# EAGLE schematic teensyv (EAGLE 6.6.0)
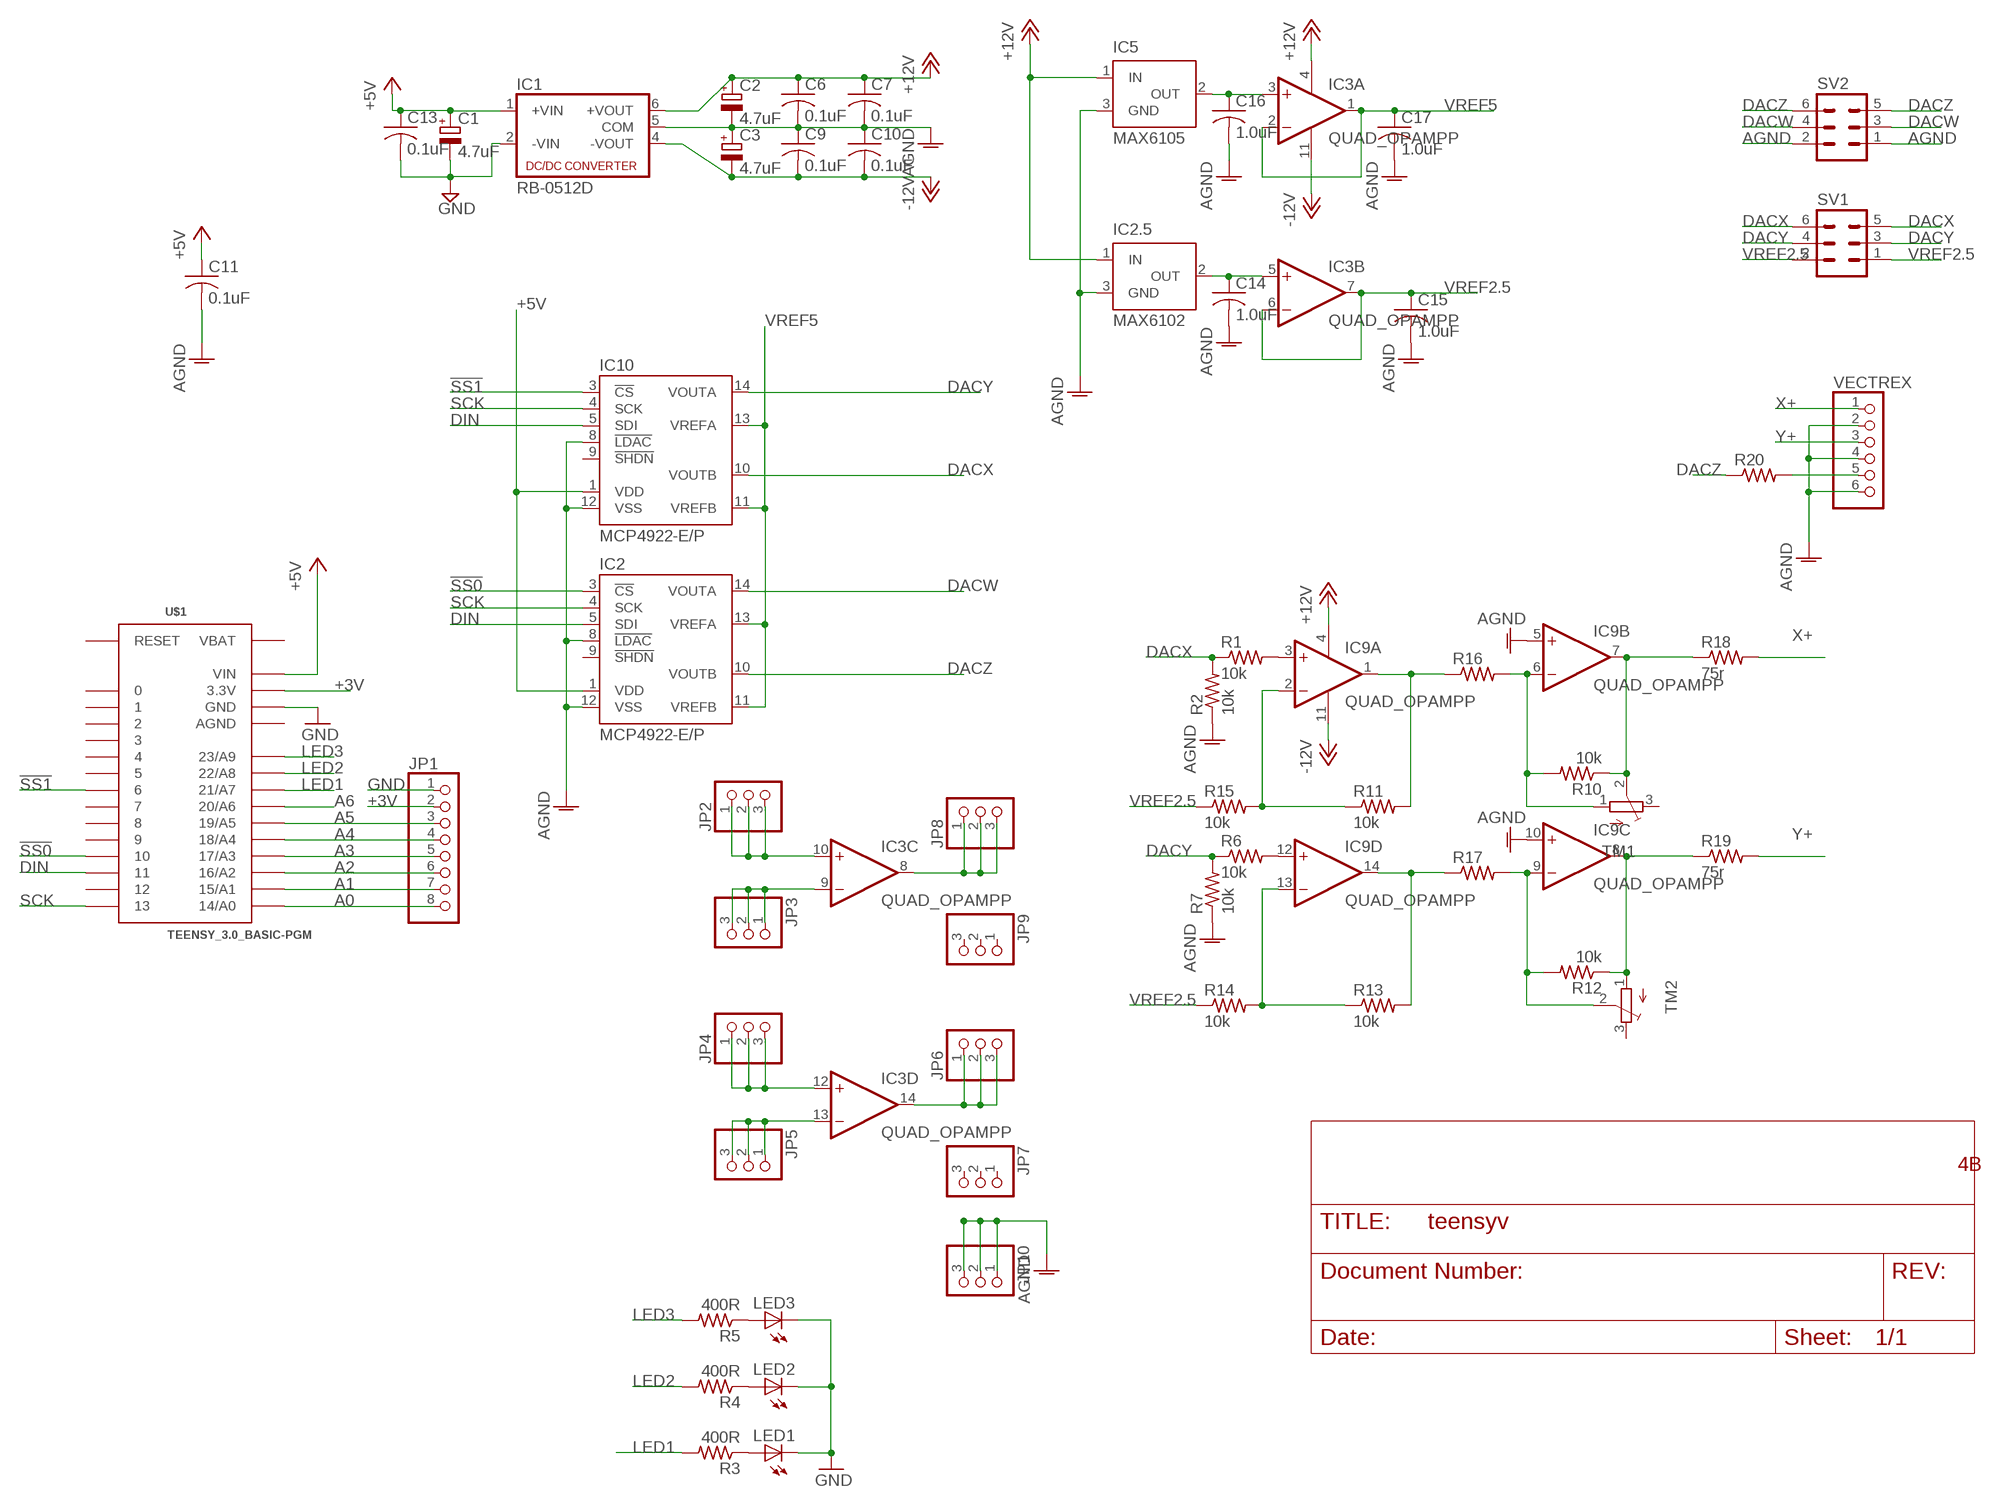
[diagram p0: schematic, sheet 1]

## Parts
C1  4.7uF  CPOL-EUE1.8-4  [E1,8-4]
C2  4.7uF  CPOL-EUE1.8-4  [E1,8-4]
C3  4.7uF  CPOL-EUE1.8-4  [E1,8-4]
C6  0.1uF  C-US025-024X044  [C025-024X044]
C7  0.1uF  C-US025-024X044  [C025-024X044]
C9  0.1uF  C-US025-024X044  [C025-024X044]
C10  0.1uF  C-US025-024X044  [C025-024X044]
C11  0.1uF  C-US025-024X044  [C025-024X044]
C13  0.1uF  C-US025-024X044  [C025-024X044]
C14  1.0uF  C-US025-024X044  [C025-024X044]
C15  1.0uF  C-US025-024X044  [C025-024X044]
C16  1.0uF  C-US025-024X044  [C025-024X044]
C17  1.0uF  C-US025-024X044  [C025-024X044]
IC1  RB-0512D  NMA  [NMA]
IC2  MCP4922-E/P  [DIL14]
IC2.5  MAX6102  MAX6520  [SOT23]
IC3  QUAD_OPAMPP  [DIL14]
IC5  MAX6105  MAX6520  [SOT23]
IC9  QUAD_OPAMPP  [DIL14]
IC10  MCP4922-E/P  [DIL14]
JP1  PINHD-1X8CLEANBIG  [1X08-CLEANBIG]
JP2  PINHD-1X3  [1X03]
JP3  PINHD-1X3  [1X03]
JP4  PINHD-1X3  [1X03]
JP5  PINHD-1X3  [1X03]
JP6  PINHD-1X3  [1X03]
JP7  PINHD-1X3  [1X03]
JP8  PINHD-1X3  [1X03]
JP9  PINHD-1X3  [1X03]
JP10  PINHD-1X3  [1X03]
LED1  LED5MM  [LED5MM]
LED2  LED5MM  [LED5MM]
LED3  LED5MM  [LED5MM]
R1  10k  R-US_0204/2V  [0204V]
R2  10k  R-US_0204/2V  [0204V]
R3  400R  R-US_0204/2V  [0204V]
R4  400R  R-US_0204/2V  [0204V]
R5  400R  R-US_0204/2V  [0204V]
R6  10k  R-US_0204/2V  [0204V]
R7  10k  R-US_0204/2V  [0204V]
R10  10k  R-US_0204/2V  [0204V]
R11  10k  R-US_0204/2V  [0204V]
R12  10k  R-US_0204/2V  [0204V]
R13  10k  R-US_0204/2V  [0204V]
R14  10k  R-US_0204/2V  [0204V]
R15  10k  R-US_0204/2V  [0204V]
R16  R-US_0204/7  [0204/7]
R17  R-US_0204/7  [0204/7]
R18  75r  R-US_0204/2V  [0204V]
R19  75r  R-US_0204/2V  [0204V]
R20  R-US_0204/7  [0204/7]
SV1  MA03-2  [MA03-2]
SV2  MA03-2  [MA03-2]
TM1  TRIMPOTTC33X  [TC33X]
TM2  TRIMPOTTC33X  [TC33X]
U$1  TEENSY_3.0_BASIC-PGM  [TEENSY_3.0_BASIC-PGM]
VECTREX  PINHD-1X6  [1X06]

## Nets
!SS0: IC2.3(!CS) U$1.10
!SS1: IC10.3(!CS) U$1.6
+3V: JP1.2 U$1.3.3V U$1.3.3V1(3.3V)
+5V: C1.+ C11.1 C13.1 IC1.1(+VIN) IC2.1(VDD) IC10.1(VDD) U$1.VIN
+12V: C2.+ C6.1 C7.1 IC1.6(+VOUT) IC2.5.1(IN) IC3.4(P:V+) IC5.1(IN) IC9.4(P:V+)
-12V: C3.- C9.2 C10.2 IC1.4(-VOUT) IC3.11(P:V-) IC9.11(P:V-)
A0: JP1.8 U$1.14/A0
A1: JP1.7 U$1.15/A1
A2: JP1.6 U$1.16/A2
A3: JP1.5 U$1.17/A3
A4: JP1.4 U$1.18/A4
A5: JP1.3 U$1.19/A5
A6: U$1.20/A6
AGND: C2.- C3.+ C6.2 C7.2 C9.1 C10.1 C11.2 C14.2 C15.2 C16.2 C17.2 IC1.5(COM) IC2.5.3(GND) IC2.8(!LDAC) IC2.12(VSS) IC5.3(GND) IC9.5(B:+IN) IC9.10(C:+IN) IC10.8(!LDAC) IC10.12(VSS) JP10.1 JP10.2 JP10.3 R2.1 R7.1 SV2.1 SV2.2 VECTREX.2 VECTREX.4 VECTREX.6
DACW: IC2.14(VOUTA) SV2.3 SV2.4
DACX: IC10.10(VOUTB) R1.1 R2.2 SV1.5 SV1.6
DACY: IC10.14(VOUTA) R6.1 R7.2 SV1.3 SV1.4
DACZ: IC2.10(VOUTB) R20.1 SV2.5 SV2.6
DIN: IC2.5(SDI) IC10.5(SDI) U$1.11
GND: C1.- C13.2 IC1.2(-VIN) JP1.1 LED1.K(C) LED2.K(C) LED3.K(C) U$1.GND U$1.GND1(GND)
LED1: R3.2 U$1.21/A7
LED2: R4.2 U$1.22/A8
LED3: R5.2 U$1.23/A9
N$1: C14.1 IC2.5.2(OUT) IC3.5(B:+IN)
N$2: IC9.3(A:+IN) R1.2
N$3: C16.1 IC3.3(A:+IN) IC5.2(OUT)
N$4: IC3.13(D:-IN) JP5.1 JP5.2 JP5.3
N$5: IC3.12(D:+IN) JP4.1 JP4.2 JP4.3
N$6: IC3.14(D:OUT) JP6.1 JP6.2 JP6.3
N$7: LED1.A R3.1
N$8: IC9.1(A:OUT) R11.2 R16.1
N$9: IC9.12(D:+IN) R6.2
N$10: IC9.2(A:-IN) R11.1 R15.2
N$11: LED2.A R4.1
N$12: LED3.A R5.1
N$13: IC9.7(B:OUT) R10.1 R18.1 TM1.2(S)
N$14: IC9.8(C:OUT) R12.1 R19.1 TM2.1(A)
N$15: IC9.14(D:OUT) R13.2 R17.1
N$16: IC9.9(C:-IN) R12.2 R17.2 TM2.2(S)
N$17: IC9.6(B:-IN) R10.2 R16.2 TM1.1(A)
N$18: IC3.9(C:-IN) JP3.1 JP3.2 JP3.3
N$19: IC3.10(C:+IN) JP2.1 JP2.2 JP2.3
N$20: IC3.8(C:OUT) JP8.1 JP8.2 JP8.3
N$23: R20.2 VECTREX.5
SCK: IC2.4(SCK) IC10.4(SCK) U$1.13
VREF2.5: C15.1 IC3.6(B:-IN) IC3.7(B:OUT) R14.1 R15.1 SV1.1 SV1.2
VREF5: C17.1 IC2.11(VREFB) IC2.13(VREFA) IC3.1(A:OUT) IC3.2(A:-IN) IC10.11(VREFB) IC10.13(VREFA)
X+: R18.2 VECTREX.1
Y+: R19.2 VECTREX.3
YFB: IC9.13(D:-IN) R13.1 R14.2
Unconnected: IC2.9(!SHDN) IC10.9(!SHDN) JP7.1 JP7.2 JP7.3 JP9.1 JP9.2 JP9.3 TM1.3(E) TM2.3(E) U$1.0 U$1.1 U$1.2 U$1.3 U$1.4 U$1.5 U$1.7 U$1.8 U$1.9 U$1.12 U$1.RESET

## Notes on the sheet
- 4B

## Power pins joined to a net without a drawn wire
AGND: U$1.AGND
VBAT: U$1.VBAT

## Library data of the parts
C1-C3 = rcl:CPOL-EU: POLARIZED CAPACITOR, European symbol
C6 C7 C9-C11 C13-C17 = adafruit:C-US: CAPACITOR, American symbol
IC1 = dc-dc-converter:NMA: DC-DC CONVERTER
IC2 IC10 = nh-ic:MCP4922: Microchip MCP4922 According to datasheet http://ww1.microchip.com/downloads/en/DeviceDoc/22250A.pdf. Created by Nils Hintze <n.hintze@elektronikpage.net>
IC2.5 IC5 = maxim:MAX6520: 1.2V Voltage Reference 50ppm/°C, SOT23, 3-Terminal Source: http://datasheets.maxim-ic.com/en/ds/MAX6520.pdf
IC3 IC9 = adafruit:QUAD_OPAMP: OP AMP Standard quad package
JP1 = adafruit:PINHD-1X8: PIN HEADER
JP2-JP10 = adafruit:PINHD-1X3: PIN HEADER
LED1-LED3 = adafruit:LED: LED OSRAM: - CHIPLED LG R971, LG N971, LY N971, LG Q971, LY Q971, LO R971, LY R971 LH N974, LH R974 LS Q976, LO Q976, LY Q976 LO Q996 - Hyper CHIPLED LW Q18S LB Q993, LB Q99A, LB R99A - SideLED LS A670, LO A670, LY A670, LG A670, LP A670 LB A673, LV A673, LT A673, LW A673 LH A674 LY A675 LS A676, LA A676, LO A676, LY A676, LW A676 LS A679, LY A679, LG A679 - Hyper Micro SIDELED® LS Y876, LA Y876, LO Y876, LY Y876 LT Y87S - SmartLED LW L88C, LW L88S LB L89C, LB L89S, LG L890 LS L89K, LO L89K, LY L89K LS L896, LA L896, LO L896, LY L896 - TOPLED LS T670, LO T670, LY T670, LG T670, LP T670 LSG T670, LSP T670, LSY T670, LOP T670, LYG T670 LG T671, LOG T671, LSG T671 LB T673, LV T673, LT T673, LW T673 LH T674 LS T676, LA T676, LO T676, LY T676, LB T676, LH T676, LSB T676, LW T676 LB T67C, LV T67C, LT T67C, LS T67K, LO T67K, LY T67K, LW E67C LS E67B, LA E67B, LO E67B, LY E67B, LB E67C, LV E67C, LT E67C LW T67C LS T679, LY T679, LG T679 LS T770, LO T770, LY T770, LG T770, LP T770 LB T773, LV T773, LT T773, LW T773 LH T774 LS E675, LA E675, LY E675, LS T675 LS T776, LA T776, LO T776, LY T776, LB T776 LHGB T686 LT T68C, LB T68C - Hyper Mini TOPLED® LB M676 - Mini TOPLED Santana® LG M470 LS M47K, LO M47K, LY M47K Source: http://www.osram.convergy.de/
R1-R7 R10-R20 = adafruit:R-US_: RESISTOR, American symbol
SV1 SV2 = con-lstb:MA03-2: PIN HEADER; OC_FARNELL: unknown; OC_NEWARK: unknown
TM1 TM2 = adafruit:TRIMPOT: SMT trimmer potentiometer part number TC33X http://www.ladyada.net/library/eagle
U$1 = Teensy3.0 2:TEENSY_3.0_BASIC-PGM: Teensy 3.0 Board outline identical to other 'basic' version except that 'PGM' pin has been omitted. See '+4', 'AllAnalogPins", and 'AllPins' packages for additional pin holes, as needed.
VECTREX = adafruit:PINHD-1X6: PIN HEADER